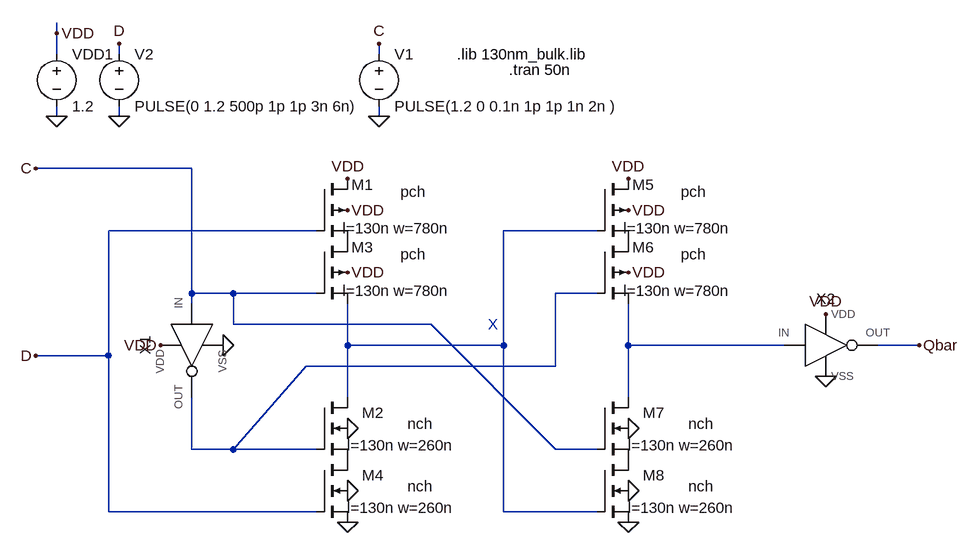
[diagram p0: schematic Prob6.asc]
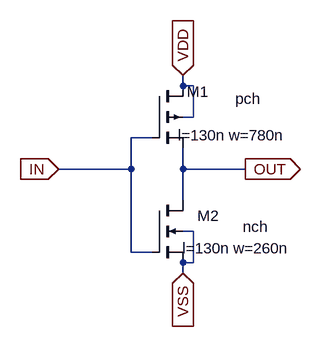
[diagram p1: sub-circuit inverter1.asc]
Prob6.asc, the LTspice schematic file:
Version 4.1
SHEET 1 1132 820
WIRE -288 48 -288 32
WIRE -288 80 -288 48
WIRE -192 80 -192 64
WIRE 208 80 208 64
WIRE -288 176 -288 160
WIRE -192 176 -192 160
WIRE 208 176 208 160
WIRE -80 256 -320 256
WIRE 112 352 -208 352
WIRE 544 352 400 352
WIRE -80 448 -80 256
WIRE -16 448 -80 448
WIRE 112 448 -16 448
WIRE 544 448 480 448
WIRE -80 464 -80 448
WIRE -16 496 -16 448
WIRE 288 496 -16 496
WIRE 160 528 160 464
WIRE 400 528 400 352
WIRE 400 528 160 528
WIRE 592 528 592 464
WIRE 832 528 592 528
WIRE 1040 528 976 528
WIRE -208 544 -208 352
WIRE -208 544 -320 544
WIRE 480 560 480 448
WIRE 480 560 96 560
WIRE 160 608 160 528
WIRE 592 608 592 528
WIRE -80 688 -80 608
WIRE -16 688 96 560
WIRE -16 688 -80 688
WIRE 112 688 -16 688
WIRE 480 688 288 496
WIRE 544 688 480 688
WIRE -208 784 -208 544
WIRE 112 784 -208 784
WIRE 400 784 400 528
WIRE 544 784 400 784
FLAG 208 176 0
FLAG 208 64 C
FLAG -192 176 0
FLAG -192 64 D
FLAG -288 176 0
FLAG -288 48 VDD
FLAG -320 544 D
FLAG -320 256 C
FLAG 1040 528 Qbar
FLAG 160 800 0
FLAG 160 752 0
FLAG 160 656 0
FLAG 592 656 0
FLAG 592 752 0
FLAG 592 800 0
FLAG 896 576 0
FLAG -32 528 0
FLAG -128 528 VDD
FLAG 160 320 VDD
FLAG 160 272 VDD
FLAG 160 416 VDD
FLAG 592 320 VDD
FLAG 592 272 VDD
FLAG 592 416 VDD
FLAG 896 480 VDD
SYMBOL voltage 208 64 R0
WINDOW 123 0 0 Left 0
WINDOW 39 0 0 Left 0
SYMATTR InstName V1
SYMATTR Value PULSE(1.2 0 0.1n 1p 1p 1n 2n )
SYMBOL voltage -192 64 R0
WINDOW 123 0 0 Left 0
WINDOW 39 0 0 Left 0
SYMATTR InstName V2
SYMATTR Value PULSE(0 1.2 500p 1p 1p 3n 6n)
SYMBOL voltage -288 64 R0
WINDOW 123 0 0 Left 2
WINDOW 39 0 0 Left 2
SYMATTR InstName VDD1
SYMATTR Value 1.2
SYMBOL Inverter1 -80 528 M90
SYMATTR InstName X1
SYMBOL pmos4 112 272 R0
WINDOW 0 88 9 Right 2
WINDOW 3 168 20 Right 2
WINDOW 123 206 76 Right 2
SYMATTR InstName M1
SYMATTR Value pch
SYMATTR Value2 l=130n w=780n
SYMBOL nmos4 112 608 R0
WINDOW 0 104 24 Right 2
WINDOW 3 179 41 Right 2
WINDOW 123 213 74 Right 2
SYMATTR InstName M2
SYMATTR Value nch
SYMATTR Value2 l=130n w=260n
SYMBOL pmos4 112 368 R0
WINDOW 0 88 9 Right 2
WINDOW 3 168 20 Right 2
WINDOW 123 206 76 Right 2
SYMATTR InstName M3
SYMATTR Value pch
SYMATTR Value2 l=130n w=780n
SYMBOL nmos4 112 704 R0
WINDOW 0 104 24 Right 2
WINDOW 3 179 41 Right 2
WINDOW 123 213 74 Right 2
SYMATTR InstName M4
SYMATTR Value nch
SYMATTR Value2 l=130n w=260n
SYMBOL pmos4 544 272 R0
WINDOW 0 88 9 Right 2
WINDOW 3 168 20 Right 2
WINDOW 123 206 76 Right 2
SYMATTR InstName M5
SYMATTR Value pch
SYMATTR Value2 l=130n w=780n
SYMBOL pmos4 544 368 R0
WINDOW 0 88 9 Right 2
WINDOW 3 168 20 Right 2
WINDOW 123 206 76 Right 2
SYMATTR InstName M6
SYMATTR Value pch
SYMATTR Value2 l=130n w=780n
SYMBOL nmos4 544 608 R0
WINDOW 0 104 24 Right 2
WINDOW 3 179 41 Right 2
WINDOW 123 213 74 Right 2
SYMATTR InstName M7
SYMATTR Value nch
SYMATTR Value2 l=130n w=260n
SYMBOL nmos4 544 704 R0
WINDOW 0 104 24 Right 2
WINDOW 3 179 41 Right 2
WINDOW 123 213 74 Right 2
SYMATTR InstName M8
SYMATTR Value nch
SYMATTR Value2 l=130n w=260n
SYMBOL Inverter1 896 528 R0
SYMATTR InstName X2
TEXT 376 496 Left 2 ;X
TEXT 328 80 Left 2 !.lib 130nm_bulk.lib
TEXT 408 104 Left 2 !.tran 50n

inverter1.asc, the sub-circuit schematic file:
Version 4.1
SHEET 1 880 680
WIRE 176 32 176 16
WIRE 192 32 176 32
WIRE 192 80 192 32
WIRE 192 80 176 80
WIRE 128 112 96 112
WIRE 96 160 96 112
WIRE 96 160 -16 160
WIRE 176 160 176 128
WIRE 272 160 176 160
WIRE 176 208 176 160
WIRE 192 256 176 256
WIRE 96 288 96 160
WIRE 128 288 96 288
WIRE 192 304 192 256
WIRE 192 304 176 304
WIRE 176 320 176 304
FLAG -16 160 IN
IOPIN -16 160 In
FLAG 176 16 VDD
IOPIN 176 16 In
FLAG 176 320 VSS
IOPIN 176 320 In
FLAG 272 160 OUT
IOPIN 272 160 Out
SYMBOL pmos4 128 32 R0
WINDOW 0 88 9 Right 2
WINDOW 3 168 20 Right 2
WINDOW 123 206 76 Right 2
SYMATTR InstName M1
SYMATTR Value pch
SYMATTR Value2 l=130n w=780n
SYMBOL nmos4 128 208 R0
WINDOW 0 104 24 Right 2
WINDOW 3 179 41 Right 2
WINDOW 123 213 74 Right 2
SYMATTR InstName M2
SYMATTR Value nch
SYMATTR Value2 l=130n w=260n

The netlist it stands for:
* Prob6.asc
V1 C 0 PULSE(1.2 0 0.1n 1p 1p 1n 2n )
V2 D 0 PULSE(0 1.2 500p 1p 1p 3n 6n)
VDD1 VDD 0 1.2
X§X1 C VDD 0 N002 inverter1
M1 VDD D P001 VDD pch l=130n w=780n
M2 N001 N002 P002 0 nch l=130n w=260n
M3 P001 C N001 VDD pch l=130n w=780n
M4 P002 D 0 0 nch l=130n w=260n
M5 VDD N001 P003 VDD pch l=130n w=780n
M6 P003 N002 N003 VDD pch l=130n w=780n
M7 N003 C P004 0 nch l=130n w=260n
M8 P004 N001 0 0 nch l=130n w=260n
X§X2 N003 VDD 0 Qbar inverter1

* block symbol definitions
.subckt inverter1 IN VDD VSS OUT
M1 VDD IN OUT VDD pch l=130n w=780n
M2 OUT IN VSS VSS nch l=130n w=260n
.ends inverter1

.model NMOS NMOS
.model PMOS PMOS
.lib standard.mos
* X
.lib 130nm_bulk.lib
.tran 50n
.backanno
.end